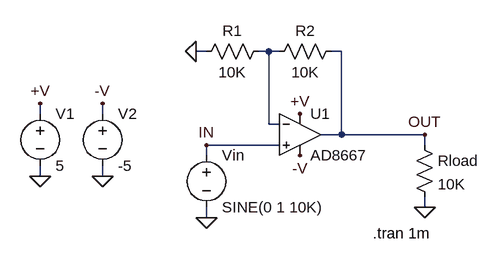
[diagram p0: schematic AD8667.asc]
AD8667.asc, the LTspice schematic file:
Version 4
SHEET 1 1240 700
WIRE 592 -976 576 -976
WIRE 688 -976 672 -976
WIRE 704 -976 688 -976
WIRE 800 -976 784 -976
WIRE 336 -880 336 -896
WIRE 432 -880 432 -896
WIRE 688 -864 688 -976
WIRE 704 -864 688 -864
WIRE 800 -848 800 -976
WIRE 800 -848 768 -848
WIRE 928 -848 800 -848
WIRE 704 -832 592 -832
WIRE 928 -832 928 -848
WIRE 592 -816 592 -832
WIRE 336 -784 336 -800
WIRE 432 -784 432 -800
WIRE 928 -736 928 -752
WIRE 592 -720 592 -736
FLAG 336 -896 +V
FLAG 336 -784 0
FLAG 592 -720 0
FLAG 928 -848 OUT
FLAG 592 -832 IN
FLAG 736 -880 +V
FLAG 432 -896 -V
FLAG 736 -816 -V
FLAG 576 -976 0
FLAG 928 -736 0
FLAG 432 -784 0
SYMBOL Opamps\\AD8667 736 -912 R0
SYMATTR InstName U1
SYMBOL voltage 336 -896 R0
WINDOW 123 0 0 Left 2
WINDOW 39 0 0 Left 2
SYMATTR InstName V1
SYMATTR Value 5
SYMBOL voltage 592 -832 R0
WINDOW 123 24 146 Left 2
WINDOW 39 24 125 Left 2
SYMATTR InstName Vin
SYMATTR Value SINE(0 1 10K)
SYMBOL res 688 -992 R90
WINDOW 0 0 56 VBottom 2
WINDOW 3 32 56 VTop 2
SYMATTR InstName R1
SYMATTR Value 10K
SYMBOL res 800 -992 R90
WINDOW 0 0 56 VBottom 2
WINDOW 3 32 56 VTop 2
SYMATTR InstName R2
SYMATTR Value 10K
SYMBOL voltage 432 -896 R0
WINDOW 123 24 146 Left 2
WINDOW 39 24 125 Left 2
SYMATTR InstName V2
SYMATTR Value -5
SYMBOL res 912 -848 R0
SYMATTR InstName Rload
SYMATTR Value 10K
TEXT 848 -696 Left 2 !.tran 1m

The netlist it stands for:
* AD8667.asc
XU1 IN N001 +V -V OUT AD8667  ; pins In+ In- V+ V- OUT
V1 +V 0 5
Vin IN 0 SINE(0 1 10K)
R1 N001 0 10K
R2 OUT N001 10K
V2 -V 0 -5
Rload OUT 0 10K
.tran 1m
.backanno
.end